# Altium schematic sheet SAFETY_SWITCH.SchDoc
size B; SheetNumber: 5; SheetTotal: 7
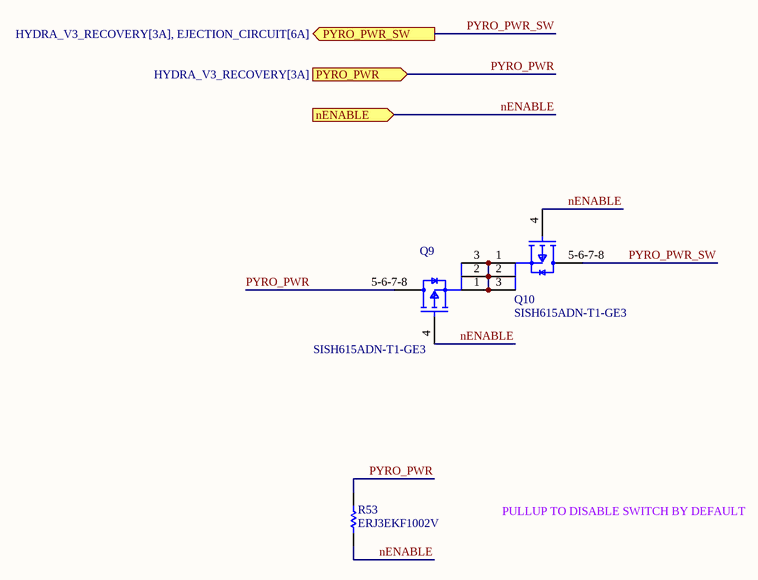
[diagram p0: SAFETY_SWITCH.SchDoc]

## Parts
Q9  SISH615ADN-T1-GE3  [SISH615ADN-T1-GE3-Footprint-1]
Q10  SISH615ADN-T1-GE3  [SISH615ADN-T1-GE3-Footprint-1]
R53  ERJ3EKF1002V  [RESC1609X55X30LL15T15]

## Ports
nENABLE (in), PYRO_PWR (in, see HYDRA_V3_RECOVERY[3A]), PYRO_PWR_SW (out, see HYDRA_V3_RECOVERY[3A], EJECTION_CIRCUIT[6A])

## Nets
nENABLE: Q9.4(G) Q10.4(G) R53.2 ; port nENABLE
PYRO_PWR: Q9.5-6-7-8(D) R53.1 ; port PYRO_PWR
PYRO_PWR_SW: Q10.5-6-7-8(D) ; port PYRO_PWR_SW
NetQ9_1: Q9.1(S) Q9.2(S) Q9.3(S) Q10.1(S) Q10.2(S) Q10.3(S)

## Notes on the sheet
- PULLUP TO DISABLE SWITCH BY DEFAULT

## Library data of the parts
Q9 Q10 = CMP-013-00036-1: Trans MOSFET P-CH 20V 22.1A 8-Pin PowerPAK 1212 EP T/R
R53 = CMP-1012-00623-3: Chip Resistor, 10 KOhm, +/- 1%, 0.1 W, -55 to 155 degC, 0603 (1608 Metric), RoHS, Tape and Reel; Manufacturer: Panasonic; Voltage Rating: 75V; Case\/Package: 0603; Power Rating: 100mW; Resistance: 10KOhm; Temperature Coefficient: 100ppm\/degreesC; Number of Pins: 2; Package Reference: 603; Depth: 0.8mm; Mount: SurfaceMount; Package Description: 2-Pin Surface Mount Device, Body 1.6 x 0.85 mm; Datasheet Version: 02/2017; Length: 1.6mm; Lead Free: LeadFree; Height: 0.45mm; Number of Terminations: 2; Max Power Dissipation: 100mW; Min Operating Temperature: -55degC; Datasheet URL: https://industrial.panasonic.com/cdbs/www-data/pdf/RDA0000/AOA0000C304.pdf; Termination: SMD/SMT; Case Code (Metric): 1608; Case Code (Imperial): 0603; Tolerance: 1%; Max Operating Temperature: 155degC; RoHSCompliant: true; Voltage Rating (DC): 75V; Radiation Hardening: No; Packaging: TapeandReel; Composition: ThickFilm; Mounting Technology: SurfaceMount; Manufacturer URL: http://www.panasonic.com/; Width: 0.031inch; REACH SVHC: NoSVHC; Contact Plating: Tin; Military Standard: Not; Package Quantity: 1